# EAGLE design Dashboardtest (EAGLE 7.6.0)
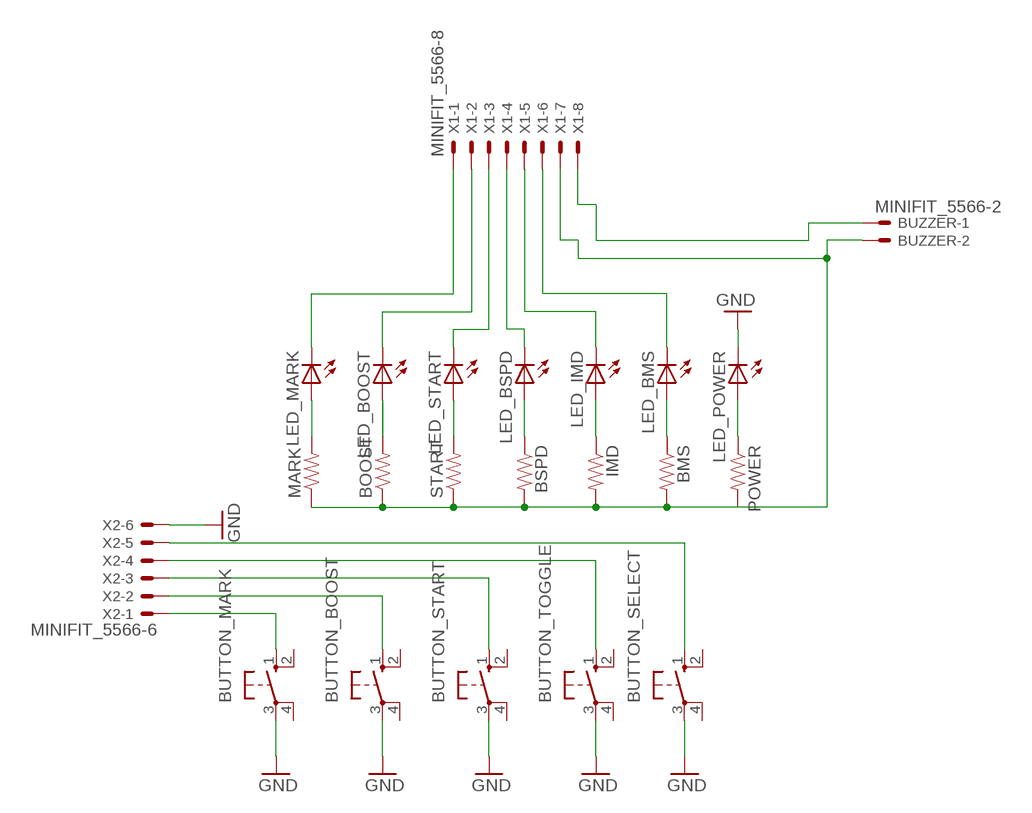
[diagram p0: schematic, sheet 1]

## Parts
BMS  RESISTOREZ  [AXIAL-0.3EZ]
BOOST  RESISTOREZ  [AXIAL-0.3EZ]
BSPD  RESISTOREZ  [AXIAL-0.3EZ]
BUTTON_BOOST  BTN_10-XX  [B3F-10XX]
BUTTON_MARK  BTN_10-XX  [B3F-10XX]
BUTTON_SELECT  BTN_10-XX  [B3F-10XX]
BUTTON_START  BTN_10-XX  [B3F-10XX]
BUTTON_TOGGLE  BTN_10-XX  [B3F-10XX]
BUZZER  MINIFIT_5566-2  [MINIFIT_5566-2]
IMD  RESISTOREZ  [AXIAL-0.3EZ]
LED_BMS  LED-5MM  [LED-5MM]
LED_BOOST  LED-5MM  [LED-5MM]
LED_BSPD  LED-5MM  [LED-5MM]
LED_IMD  LED-5MM  [LED-5MM]
LED_MARK  LED-5MM  [LED-5MM]
LED_POWER  LED-5MM  [LED-5MM]
LED_START  LED-5MM  [LED-5MM]
MARK  RESISTOREZ  [AXIAL-0.3EZ]
POWER  RESISTOREZ  [AXIAL-0.3EZ]
START  RESISTOREZ  [AXIAL-0.3EZ]
X1  MINIFIT_5566-8  [MINIFIT_5566-8]
X2  MINIFIT_5566-6  [MINIFIT_5566-6]

## Nets
20: BMS.P$2 BOOST.P$1 BSPD.P$2 BUZZER.2 IMD.P$2 MARK.P$1 POWER.P$2 START.P$1 X1.7
GND: BUTTON_BOOST.3(P) BUTTON_MARK.3(P) BUTTON_SELECT.3(P) BUTTON_START.3(P) BUTTON_TOGGLE.3(P) LED_POWER.K(C) X2.6
LED_IMD: IMD.P$1 LED_IMD.A
N$1: LED_POWER.A POWER.P$1
N$2: BMS.P$1 LED_BMS.A
N$3: LED_MARK.K(C) X1.1
N$4: BSPD.P$1 LED_BSPD.A
N$5: LED_BOOST.K(C) X1.2
N$6: LED_START.K(C) X1.3
N$7: LED_BSPD.K(C) X1.4
N$8: BUZZER.1 X1.8
N$9: LED_IMD.K(C) X1.5
N$10: LED_MARK.A MARK.P$2
N$11: BOOST.P$2 LED_BOOST.A
N$12: LED_START.A START.P$2
N$13: LED_BMS.K(C) X1.6
N$15: BUTTON_MARK.1(S) X2.1
N$16: BUTTON_BOOST.1(S) X2.2
N$17: BUTTON_START.1(S) X2.3
N$18: BUTTON_TOGGLE.1(S) X2.4
N$19: BUTTON_SELECT.1(S) X2.5
Unconnected: BUTTON_BOOST.2(S1) BUTTON_BOOST.4(P1) BUTTON_MARK.2(S1) BUTTON_MARK.4(P1) BUTTON_SELECT.2(S1) BUTTON_SELECT.4(P1) BUTTON_START.2(S1) BUTTON_START.4(P1) BUTTON_TOGGLE.2(S1) BUTTON_TOGGLE.4(P1)

## Library data of the parts
BMS BOOST BSPD IMD MARK POWER START = HyTechDevices:RESISTOR: Resistor Basic schematic elements and footprints for 0603, 1206, and PTH resistors.
BUTTON_BOOST BUTTON_MARK BUTTON_SELECT BUTTON_START BUTTON_TOGGLE = HyTechDevices:BTN_10-XX: OMRON SWITCH; MPN: B3F-1000; OC_FARNELL: 176432; OC_NEWARK: 36M3542
BUZZER = HyTechDevices:MINIFIT_5566-2: Mini FIT Junior connector 2 pole Source: http://www.molex.com; OC_FARNELL: 1822072; OC_NEWARK: unknown
LED_BMS LED_BOOST LED_BSPD LED_IMD LED_MARK LED_POWER LED_START = HyTechDevices:LED: Light Emitting Diode Source: Dangerous Prototypes Eagle Library <https://github.com/DangerousPrototypes/Eagle_Part_Library>
X1 = HyTechDevices:MINIFIT_5566-8: Mini FIT Junior connector 8 pole Source: http://www.molex.com; OC_FARNELL: unknown; OC_NEWARK: unknown
X2 = HyTechDevices:MINIFIT_5566-6: Mini FIT Junior connector 6 pole Source: http://www.molex.com; MPN: 95566-61002; OC_FARNELL: unknown; OC_NEWARK: 22K8620

## Board
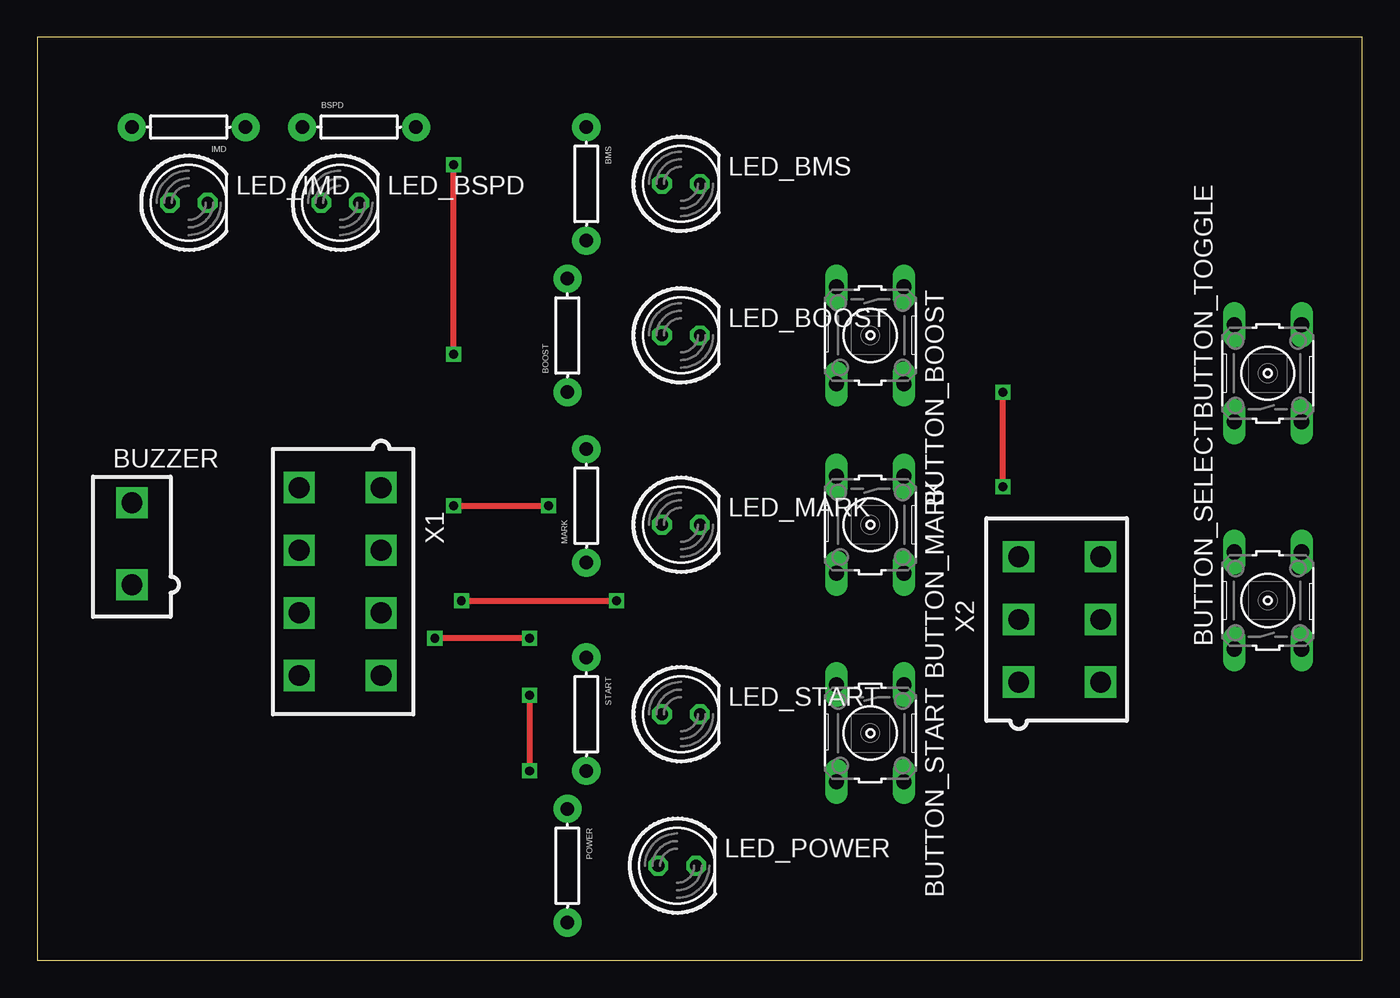
[diagram p1: board, top side]
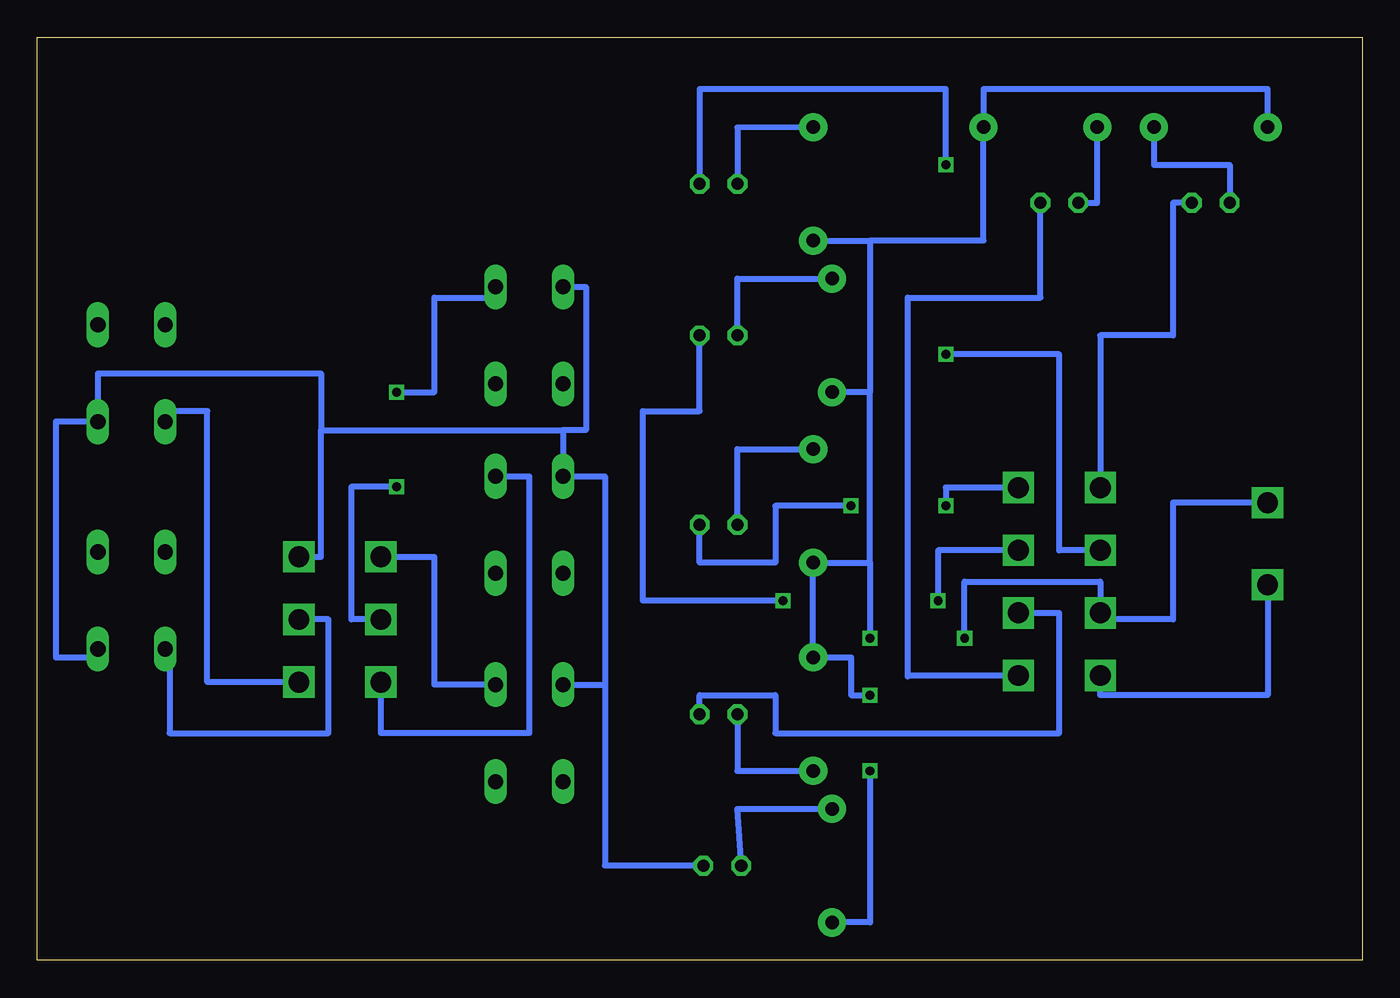
[diagram p2: board, bottom side, seen from below]

Size 88.88 x 61.9 mm. Coordinates in mm from the lower left corner, seen from the top.
Outline: 0,0 88.88,0 88.88,61.9 0,61.9 0,0
Copper layers (1*16): Top 0.035mm / dielectric 1.5mm / Bottom 0.035mm
Design rules "default": minimum track width 10mil, minimum drill 24mil, track to track 8mil, track to pad 8mil, pad to pad 8mil, via to via 8mil, smd to smd 8mil, copper to edge 40mil, drill to drill 8mil, minimum pad ring 10mil, minimum via ring 8mil, stop-mask expansion 4mil, vias tented up to drill 0mil, thermal gap 10mil

### Footprints (pad centres in the part's own frame; a part is rotated, then mirrored left to right if it is on the bottom)
AXIAL-0.3EZ = drill 0.9 pad 1.88: P$1 -3.81,0; P$2 3.81,0
B3F-10XX = drill 1.016 long: 1 -3.251,2.261; 2 3.251,2.261; 3 -3.251,-2.261; 4 3.251,-2.261
MINIFIT_5566-2 = drill 1.4 square: 1 0,-2.75; 2 0,2.75
LED-5MM = drill 0.813 octagon: A -1.27,0; K 1.27,0
MINIFIT_5566-8 = drill 1.4 square: 1 6.3,-2.75; 2 2.1,-2.75; 3 -2.1,-2.75; 4 -6.3,-2.75; 5 6.3,2.75; 6 2.1,2.75; 7 -2.1,2.75; 8 -6.3,2.75
MINIFIT_5566-6 = drill 1.4 square: 1 4.2,-2.75; 2 0,-2.75; 3 -4.2,-2.75; 4 4.2,2.75; 5 0,2.75; 6 -4.2,2.75

### Placement (x,y rotation side)
BMS  36.83,52.07 270 top
BOOST  35.56,41.91 90 top
BSPD  21.59,55.88 0 top
BUTTON_BOOST  55.88,41.91 270 top
BUTTON_MARK  55.88,29.21 270 top
BUTTON_SELECT  82.55,24.13 90 top
BUTTON_START  55.88,15.24 270 top
BUTTON_TOGGLE  82.55,39.37 90 top
BUZZER  6.35,27.94 0 top
IMD  10.16,55.88 180 top
LED_BMS  43.18,52.07 0 top
LED_BOOST  43.18,41.91 0 top
LED_BSPD  20.32,50.8 0 top
LED_IMD  10.16,50.8 0 top
LED_MARK  43.18,29.21 0 top
LED_POWER  42.93,6.35 0 top
LED_START  43.18,16.51 0 top
MARK  36.83,30.48 90 top
POWER  35.56,6.35 270 top
START  36.83,16.51 270 top
X1  20.32,25.4 90 top
X2  68.58,22.86 270 top

### Tracks (layer width: path | path; a pad name or v marks a point on that pad's centre or on a via)
20  (via drill 0.6)
  Top 0.406: v33.02,17.78 v33.02,12.7 | v33.02,21.59 v26.67,21.59
  Bottom 0.406: 33.02,48.26 25.4,48.26 BSPD.P$2 25.4,58.42 6.35,58.42 IMD.P$2 | 36.08,48.26 BMS.P$2 33.02,48.26 | 33.02,26.67 MARK.P$1 START.P$1 34.29,20.32 34.29,17.78 v33.02,17.78 | 33.02,26.67 33.02,38.1 | 33.02,38.1 BOOST.P$1 | 33.02,48.26 33.02,38.1 | v33.02,12.7 33.02,2.54 POWER.P$2 | BUZZER.2 12.7,30.69 12.7,22.86 17.57,22.86 X1.7 17.57,25.4 26.67,25.4 v26.67,21.59 | 33.02,26.67 v33.02,21.59
GND
  Bottom 0.406: BUTTON_SELECT.3 84.81,20.32 87.63,20.32 87.63,36.12 BUTTON_TOGGLE.3 84.81,39.37 69.85,39.37 69.85,35.56 | X2.6 69.85,27.06 69.85,35.56 | 69.85,35.56 53.62,35.56 | 53.62,35.56 BUTTON_MARK.3 50.8,32.46 50.8,18.49 | BUTTON_BOOST.3 52.07,45.16 52.07,35.56 53.62,35.56 | 50.8,18.49 50.8,6.35 LED_POWER.K | BUTTON_START.3 50.8,18.49
LED_IMD
  Bottom 0.406: IMD.P$1 13.97,53.34 8.89,53.34 LED_IMD.A
N$1
  Bottom 0.406: LED_POWER.A 41.91,10.16 POWER.P$1
N$2
  Bottom 0.406: BMS.P$1 41.91,55.84 LED_BMS.A
N$3  (via drill 0.6)
  Top 0.406: v27.94,30.48 v34.29,30.48
  Bottom 0.406: X1.1 27.94,31.7 v27.94,30.48 | v34.29,30.48 39.37,30.48 39.37,26.67 44.45,26.67 LED_MARK.K
N$4
  Bottom 0.406: LED_BSPD.A 17.78,50.8 BSPD.P$1
N$5  (via drill 0.6)
  Top 0.406: v28.45,24.13 v38.86,24.13
  Bottom 0.406: X1.2 28.45,27.5 v28.45,24.13 | v38.86,24.13 48.26,24.13 48.26,36.83 44.45,36.83 LED_BOOST.K
N$6
  Bottom 0.406: LED_START.K 44.45,17.78 39.37,17.78 39.37,15.24 20.32,15.24 20.32,23.3 X1.3
N$7
  Bottom 0.406: X1.4 30.48,19.1 | 30.48,19.1 30.48,19.05 | 30.48,19.1 30.48,44.45 21.59,44.45 LED_BSPD.K
N$8
  Bottom 0.406: BUZZER.1 6.35,17.78 17.57,17.78 X1.8
N$9
  Bottom 0.406: LED_IMD.K 12.7,50.8 12.7,41.91 17.57,41.91 X1.5
N$10
  Bottom 0.406: LED_MARK.A 41.91,34.29 MARK.P$2
N$11
  Bottom 0.406: LED_BOOST.A 41.91,45.72 BOOST.P$2
N$12
  Bottom 0.406: LED_START.A 41.91,12.7 START.P$2
N$13  (via drill 0.6)
  Top 0.406: v27.94,40.64 v27.94,53.34
  Bottom 0.406: X1.6 20.32,27.5 20.32,40.64 v27.94,40.64 | v27.94,53.34 27.94,58.42 44.45,58.42 LED_BMS.K
N$15
  Bottom 0.406: BUTTON_MARK.1 55.88,32.46 55.88,15.24 65.83,15.24 X2.1
N$16  (via drill 0.6)
  Top 0.406: v64.77,31.75 v64.77,38.1
  Bottom 0.406: X2.2 67.82,22.86 67.82,31.75 v64.77,31.75 | v64.77,38.1 62.23,38.1 62.23,44.45 58.14,44.45 BUTTON_BOOST.1
N$17
  Bottom 0.406: BUTTON_START.1 62.23,18.49 62.23,27.06 X2.3
N$18
  Bottom 0.406: X2.4 77.47,18.66 77.47,36.83 80.29,36.83 BUTTON_TOGGLE.1
N$19
  Bottom 0.406: BUTTON_SELECT.1 80.01,20.88 80.01,15.24 69.34,15.24 69.34,22.86 X2.5